# Altium schematic sheet USB-B_Mini.SchDoc
size A4
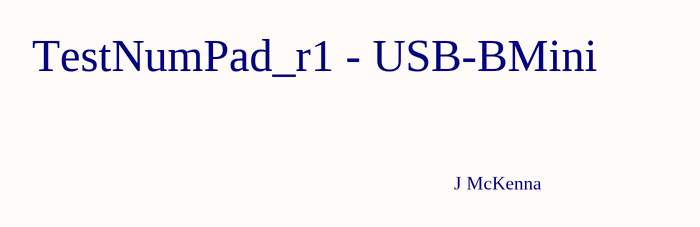
[diagram p0: USB-B_Mini.SchDoc]

## Notes on the sheet
- TestNumPad_r1 - USB-BMini
- J McKenna